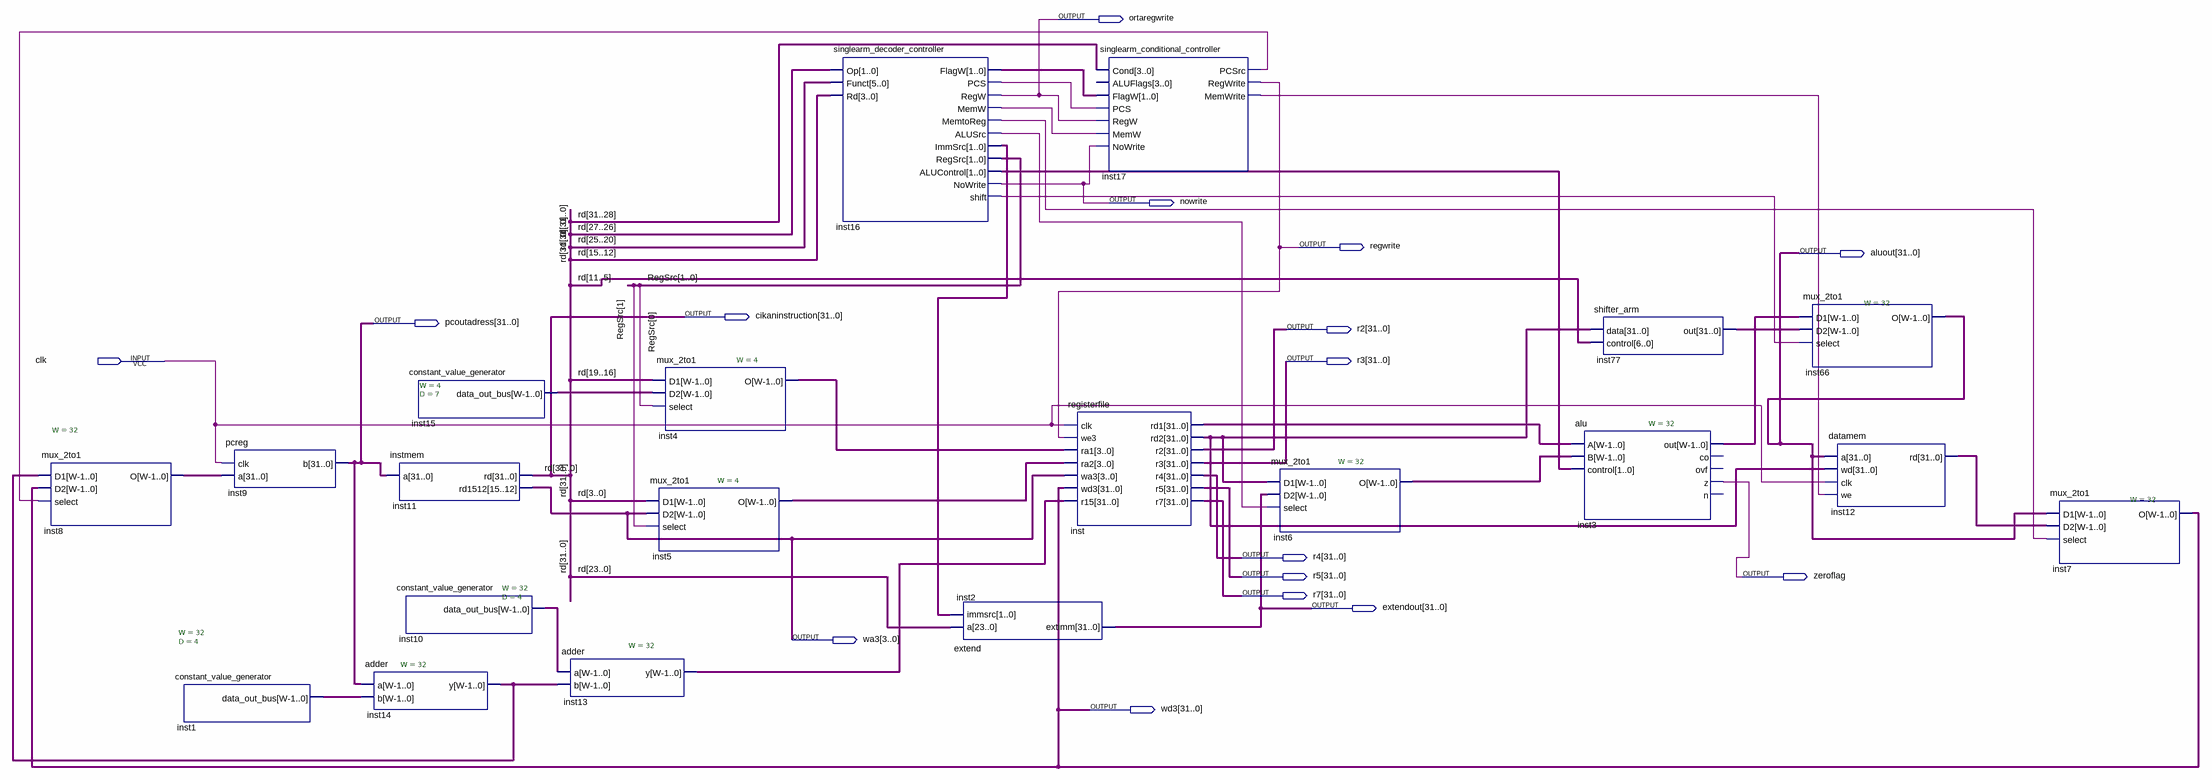
[diagram p0: schematic sheet]
// Quartus schematic singlecyclearm.bdf as structural Verilog: 20 symbols, 16 pins
module singlecyclearm (
  input  clk,
  output ortaregwrite,
  output nowrite,
  output regwrite,
  output [31:0] aluout,
  output [31:0] cikaninstruction,
  output [31:0] pcoutadress,
  output [31:0] r2,
  output [31:0] r3,
  output [31:0] r4,
  output [31:0] r5,
  output zeroflag,
  output [31:0] r7,
  output [31:0] extendout,
  output [3:0] wa3,
  output [31:0] wd3
);

  wire inst16_alusrc, inst16_memtoreg, inst16_memw, inst16_pcs, inst16_shift, inst17_memwrite, inst17_pcsrc;
  wire [1:0] inst16_alucontrol, inst16_flagw, inst16_immsrc, RegSrc;
  wire [3:0] inst4_o, inst5_o, inst15_data_out_bus;
  wire [31:0] inst1_data_out_bus, inst3_out, inst6_o, inst8_o, inst10_data_out_bus, inst12_rd, inst13_y,
       inst14_y, inst77_out, inst_rd1, inst_rd2;

  mux_2to1 #(.W(32)) inst8 (.D1(inst14_y), .D2(wd3), .select(inst17_pcsrc), .O(inst8_o));
  constant_value_generator #(.W(32), .D(4)) inst1 (.data_out_bus(inst1_data_out_bus));
  pcreg inst9 (.clk(clk), .a(inst8_o), .b(pcoutadress));
  adder #(.W(32)) inst14 (.a(pcoutadress), .b(inst1_data_out_bus), .y(inst14_y));
  constant_value_generator #(.W(4), .D(7)) inst15 (.data_out_bus(inst15_data_out_bus));
  instmem inst11 (.a(pcoutadress), .rd(cikaninstruction), .rd1512(wa3));
  constant_value_generator #(.W(32), .D(4)) inst10 (.data_out_bus(inst10_data_out_bus));
  adder #(.W(32)) inst13 (.a(inst10_data_out_bus), .b(inst14_y), .y(inst13_y));
  mux_2to1 #(.W(4)) inst4 (.D1(cikaninstruction[19:16]), .D2(inst15_data_out_bus), .select(RegSrc[0]), .O(inst4_o));
  mux_2to1 #(.W(4)) inst5 (.D1(cikaninstruction[3:0]), .D2(wa3), .select(RegSrc[1]), .O(inst5_o));
  singlearm_decoder_controller inst16 (
    .Op(cikaninstruction[27:26]), .Funct(cikaninstruction[25:20]), .Rd(cikaninstruction[15:12]),
    .FlagW(inst16_flagw), .PCS(inst16_pcs), .RegW(ortaregwrite), .MemW(inst16_memw),
    .MemtoReg(inst16_memtoreg), .ALUSrc(inst16_alusrc), .ImmSrc(inst16_immsrc), .RegSrc(RegSrc),
    .ALUControl(inst16_alucontrol), .NoWrite(nowrite), .shift(inst16_shift));
  extend inst2 (.a(cikaninstruction[23:0]), .immsrc(inst16_immsrc), .extimm(extendout));
  registerfile inst (
    .clk(clk), .we3(regwrite), .ra1(inst4_o), .ra2(inst5_o), .wa3(wa3), .wd3(wd3), .r15(inst13_y),
    .rd1(inst_rd1), .rd2(inst_rd2), .r2(r2), .r3(r3), .r4(r4), .r5(r5), .r7(r7));
  singlearm_conditional_controller inst17 (
    .Cond(cikaninstruction[31:28]), .FlagW(inst16_flagw), .PCS(inst16_pcs), .RegW(ortaregwrite),
    .MemW(inst16_memw), .NoWrite(nowrite), .PCSrc(inst17_pcsrc), .RegWrite(regwrite),
    .MemWrite(inst17_memwrite));  // open: ALUFlags
  mux_2to1 #(.W(32)) inst6 (.D1(inst_rd2), .D2(extendout), .select(inst16_alusrc), .O(inst6_o));
  shifter_arm inst77 (.data(inst_rd2), .control(cikaninstruction[11:5]), .out(inst77_out));
  alu #(.W(32)) inst3 (
    .A(inst_rd1), .B(inst6_o), .control(inst16_alucontrol), .out(inst3_out), .z(zeroflag));  // open: co, ovf, n
  mux_2to1 #(.W(32)) inst66 (.D1(inst3_out), .D2(inst77_out), .select(inst16_shift), .O(aluout));
  datamem inst12 (.a(aluout), .wd(inst_rd2), .clk(clk), .we(inst17_memwrite), .rd(inst12_rd));
  mux_2to1 #(.W(32)) inst7 (.D1(aluout), .D2(inst12_rd), .select(inst16_memtoreg), .O(wd3));

  // Other names for the same wires on the sheet: rd[31:0] = cikaninstruction
endmodule
